# EAGLE design SPI_to_4x7SD-v22 (EAGLE 5.04)
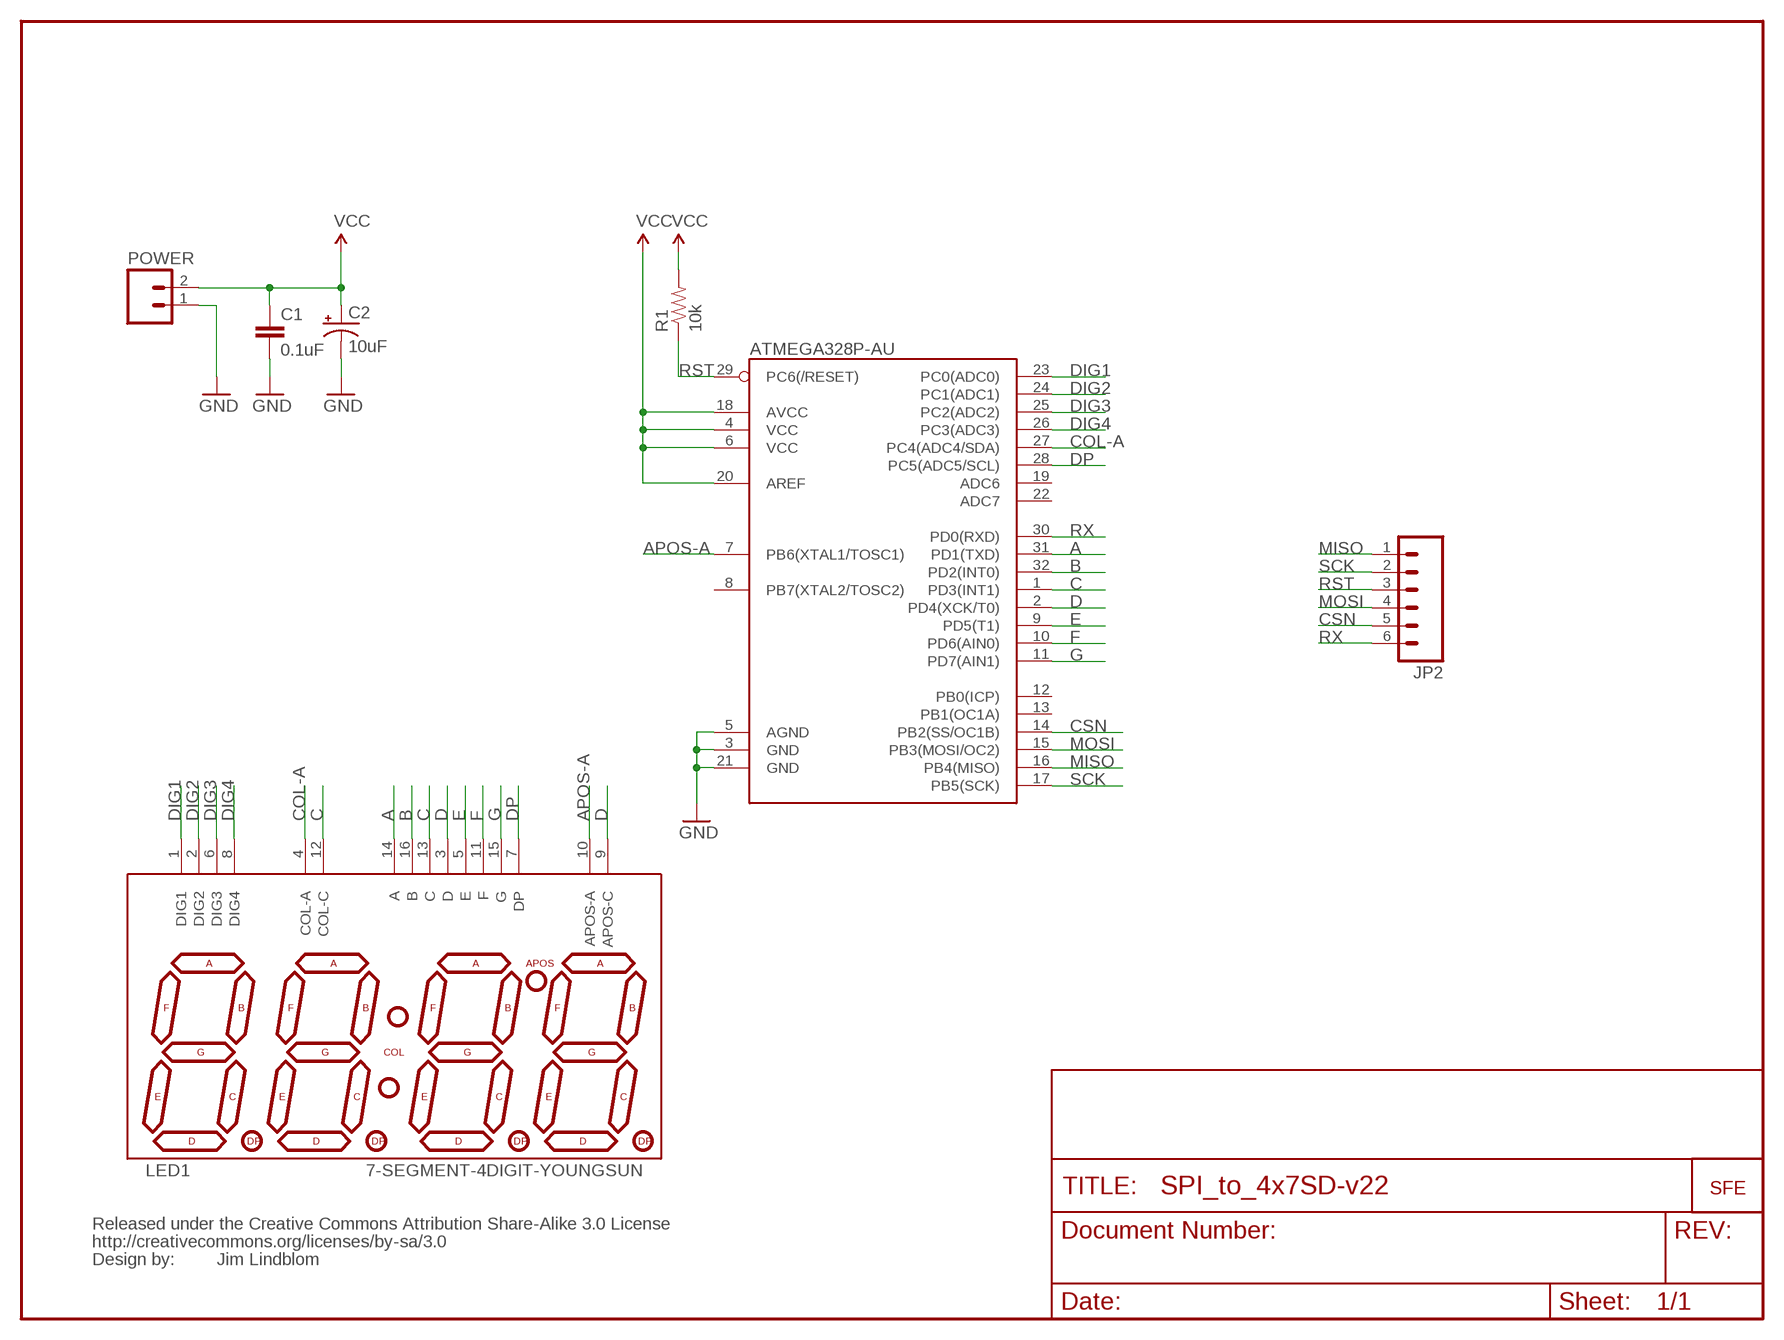
[diagram p0: schematic, sheet 1]

## Parts
ATMEGA328P-AU  ATMEGA328P-AU  ATMEGA168  [TQFP32-08]
C1  0.1uF  CAP0402-CAP  [0402-CAP]
C2  10uF  CAP_POL1206  [EIA3216]
JP2  M06SIP  [1X06]
LED1  7-SEGMENT-4DIGIT-YOUNGSUN  [7-SEGMENT-4DIGIT-YOUNGSUN]
POWER  JP2  M02PTH  [1X02]
R1  10k  RESISTOR0402-RES  [0402-RES]
U$1  CREATIVE_COMMONS  [CREATIVE_COMMONS]
U$3  LOGO-SFESK  [SFE-LOGO-FLAME]

## Nets
A: ATMEGA328P-AU.31(PD1(TXD)) LED1.14(A)
APOS-A: ATMEGA328P-AU.7(PB6(XTAL1/TOSC1)) LED1.10(APOS-A)
B: ATMEGA328P-AU.32(PD2(INT0)) LED1.16(B)
C: ATMEGA328P-AU.1(PD3(INT1)) LED1.12(COL-C) LED1.13(C)
COL-A: ATMEGA328P-AU.27(PC4(ADC4/SDA)) LED1.4(COL-A)
CSN: ATMEGA328P-AU.14(PB2(SS/OC1B)) JP2.5
D: ATMEGA328P-AU.2(PD4(XCK/T0)) LED1.3(D) LED1.9(APOS-C)
DIG1: ATMEGA328P-AU.23(PC0(ADC0)) LED1.1(DIG1)
DIG2: ATMEGA328P-AU.24(PC1(ADC1)) LED1.2(DIG2)
DIG3: ATMEGA328P-AU.25(PC2(ADC2)) LED1.6(DIG3)
DIG4: ATMEGA328P-AU.26(PC3(ADC3)) LED1.8(DIG4)
DP: ATMEGA328P-AU.28(PC5(ADC5/SCL)) LED1.7(DP)
E: ATMEGA328P-AU.9(PD5(T1)) LED1.5(E)
F: ATMEGA328P-AU.10(PD6(AIN0)) LED1.11(F)
G: ATMEGA328P-AU.11(PD7(AIN1)) LED1.15(G)
GND: ATMEGA328P-AU.3(GND) ATMEGA328P-AU.5(AGND) ATMEGA328P-AU.21(GND) C1.2 C2.C(-) POWER.1
MISO: ATMEGA328P-AU.16(PB4(MISO)) JP2.1
MOSI: ATMEGA328P-AU.15(PB3(MOSI/OC2)) JP2.4
RST: ATMEGA328P-AU.29(PC6(/RESET)) JP2.3 R1.1
RX: ATMEGA328P-AU.30(PD0(RXD)) JP2.6
SCK: ATMEGA328P-AU.17(PB5(SCK)) JP2.2
VCC: ATMEGA328P-AU.4(VCC) ATMEGA328P-AU.6(VCC) ATMEGA328P-AU.18(AVCC) ATMEGA328P-AU.20(AREF) C1.1 C2.A(+) POWER.2 R1.2
Unconnected: ATMEGA328P-AU.8(PB7(XTAL2/TOSC2)) ATMEGA328P-AU.12(PB0(ICP)) ATMEGA328P-AU.13(PB1(OC1A)) ATMEGA328P-AU.19(ADC6) ATMEGA328P-AU.22(ADC7)

## Notes on the sheet
- Jim Lindblom

## Library data of the parts
ATMEGA328P-AU = SparkFun:ATMEGA168
C1 = SparkFun:CAP: Capacitor Standard 0603 ceramic capacitor, and 0.1" leaded capacitor.
C2 = SparkFun:CAP_POL: Capacitor Polarized These are standard SMD and PTH capacitors. Normally 10uF, 47uF, and 100uF in electrolytic and tantalum varieties. Always verify the external diameter of the through hole cap, it varies with capacity, voltage, and manufacturer. The EIA devices should be standard.
JP2 = SparkFun:M06: Header 6 Standard 6-pin 0.1" header. Use with straight break away headers (SKU : PRT-00116), right angle break away headers (PRT-00553), swiss pins (PRT-00743), machine pins (PRT-00117), and female headers (PRT-00115). Molex polarized connector foot print use with SKU : PRT-08094 with associated crimp pins and housings. NOTES ON THE VARIANTS LOCK and LOCK_LONGPADS... This footprint was designed to help hold the alignment of a through-hole component (i.e. 6-pin header) while soldering it into place. You may notice that each hole has been shifted either up or down by 0.005 of an inch from it's more standard position (which is a perfectly straight line). This slight alteration caused the pins (the squares in the middle) to touch the edges of the holes. Because they are alternating, it causes a "brace" to hold the component in place. 0.005 has proven to be the perfect amount of "off-center" position when using our standard breakaway headers. Although looks a little odd when you look at the bare footprint, once you have a header in there, the alteration is very hard to notice. Also, if you push a header all the way into place, it is covered up entirely on the bottom side. This idea of altering the position of holes to aid alignment will be further integrated into the Sparkfun Library for other footprints. It can help hold any component with 3 or more connection pins.
LED1 = SparkFun:7-SEGMENT-4DIGIT-YOUNGSUN: This is a part for the 4-Digit 7-segment LEDs from Young Sun. Different from the Digikey LEDs, all 16 pins are used. The LONGPADS Variant is used for a test jig, but you may like it because there is more pad to solder to. If you are concerned about routing space, the standard works just fine though.
POWER = SparkFun:M02: Header 2 Standard 2-pin 0.1" header. Use with straight break away headers (SKU : PRT-00116), right angle break away headers (PRT-00553), swiss pins (PRT-00743), machine pins (PRT-00117), and female headers (PRT-00115). Molex polarized connector foot print use with SKU : PRT-08233 with associated crimp pins and housings.
R1 = SparkFun:RESISTOR: Resistor Basic schematic elements and footprints for 0603, 1206, and PTH 1/10th watt (small) resistors.
U$1 = SparkFun:CREATIVE_COMMONS
U$3 = SparkFun:LOGO-SFE: Spark Fun Electronics PCB Logo This is the standard Spark Fun Electronics PCB logo.

## Board
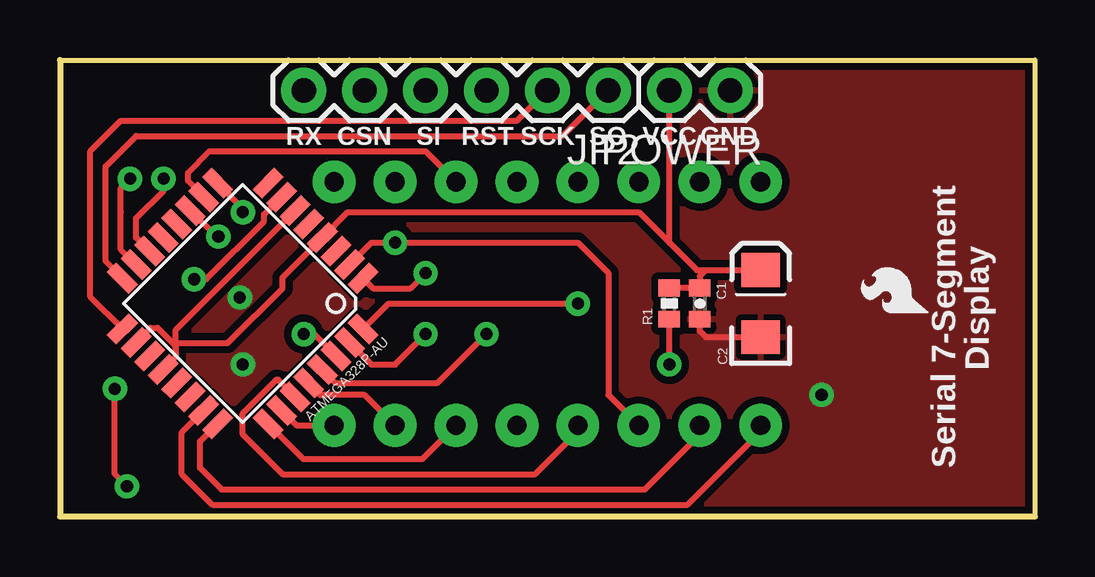
[diagram p1: board, top side]
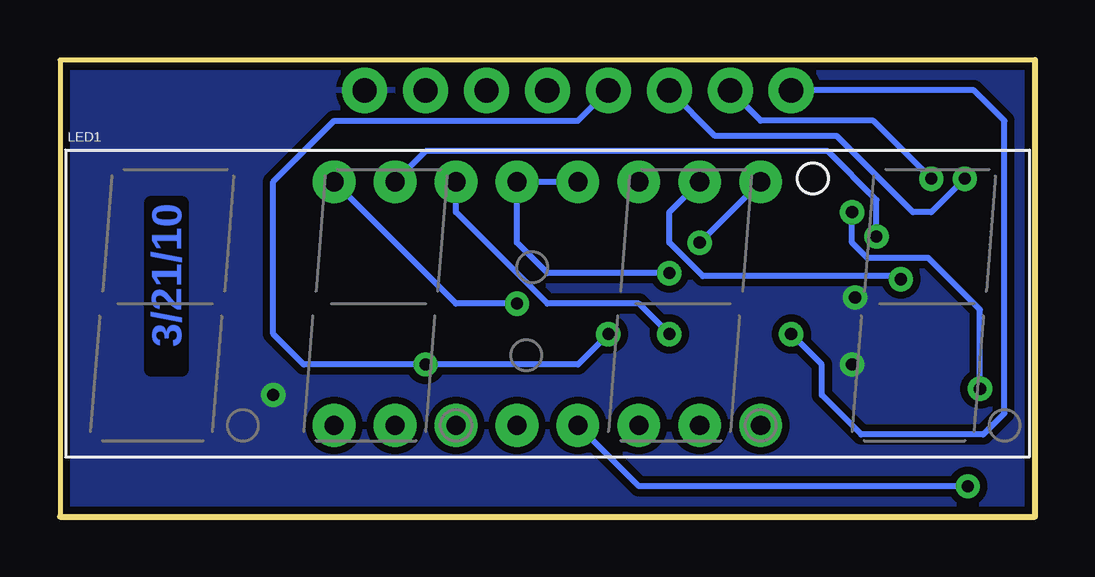
[diagram p2: board, bottom side, seen from below]

Size 40.64 x 19.05 mm. Coordinates in mm from the lower left corner, seen from the top.
Outline: 0,19.05 40.64,19.05 40.64,0 0,0 0,19.05
Copper layers (1*16): Top 0.035mm / dielectric 1.5mm / Bottom 0.035mm
Design rules "SparkFun": minimum track width 8mil, minimum drill 20mil, track to track 8mil, track to pad 8mil, pad to pad 8mil, via to via 8mil, smd to smd 8mil, copper to edge 10mil, drill to drill 8mil, minimum pad ring 12mil, minimum via ring 10mil, stop-mask expansion 4mil, vias tented up to drill 25mil, thermal gap 10mil

### Footprints (pad centres in the part's own frame; a part is rotated, then mirrored left to right if it is on the bottom)
TQFP32-08 = smd 1.27 x 0.559: 1 -4.293,2.8; 2 -4.293,2; 3 -4.293,1.2; 4 -4.293,0.4; 5 -4.293,-0.4; 6 -4.293,-1.2; 7 -4.293,-2; 8 -4.293,-2.8; 17 4.293,-2.8; 18 4.293,-2; 19 4.293,-1.2; 20 4.293,-0.4; 21 4.293,0.4; 22 4.293,1.2; 23 4.293,2; 24 4.293,2.8 | smd 0.559 x 1.27: 9 -2.8,-4.293; 10 -2,-4.293; 11 -1.2,-4.293; 12 -0.4,-4.293; 13 0.4,-4.293; 14 1.2,-4.293; 15 2,-4.293; 16 2.8,-4.293; 25 2.8,4.293; 26 2,4.293; 27 1.2,4.293; 28 0.4,4.293; 29 -0.4,4.293; 30 -1.2,4.293; 31 -2,4.293; 32 -2.8,4.293
0402-CAP = smd 0.7 x 0.9: 1 -0.65,0; 2 0.65,0
EIA3216 = smd 1.4 x 1.6: A 1.4,0; C -1.4,0
1X06 = drill 1.016 pad 1.88 round: 1 0,0; 2 2.54,0; 3 5.08,0; 4 7.62,0; 5 10.16,0; 6 12.7,0
7-SEGMENT-4DIGIT-YOUNGSUN = drill 0.8 pad 1.778 round: 1 -8.89,-5.08; 2 -6.35,-5.08; 3 -3.81,-5.08; 4 -1.27,-5.08; 5 1.27,-5.08; 6 3.81,-5.08; 7 6.35,-5.08; 8 8.89,-5.08; 9 8.89,5.08; 10 6.35,5.08; 11 3.81,5.08; 12 1.27,5.08; 13 -1.27,5.08; 14 -3.81,5.08; 15 -6.35,5.08; 16 -8.89,5.08
1X02 = drill 1.016 pad 1.88 round: 1 0,0; 2 2.54,0
0402-RES = smd 0.7 x 0.9: 1 -0.65,0; 2 0.65,0

### Placement (x,y rotation side)
ATMEGA328P-AU  7.62,8.89 225 top
C1  26.67,8.89 270 top
C2  29.21,8.89 90 top
JP2  22.86,17.78 180 top
LED1  20.32,8.89 0 bottom
POWER  27.94,17.78 180 top
R1  25.4,8.89 90 top
U$1  20.32,-7.62 0 top  (outside the outline)
U$3  36.2,8.51 90 top

### Tracks (layer width: path | path; a pad name or v marks a point on that pad's centre or on a via)
A  (via drill 0.51)
  Top 0.254: ATMEGA328P-AU.31 12.99,6.35 13.97,6.35 v15.24,7.62
  Bottom 0.254: v15.24,7.62 16.51,8.89 20.32,8.89 24.13,12.7 LED1.14
APOS-A  (via drill 0.51)
  Top 0.254: ATMEGA328P-AU.7 8.51,12.61 8.51,12.32 6.1,9.91 v5.59,9.91
  Bottom 0.254: LED1.10 15.24,12.7 15.24,11.43 13.84,10.03 5.71,10.03 v5.59,9.91
B  (via drill 0.51)
  Top 0.254: ATMEGA328P-AU.32 13.69,8.89 v21.59,8.89
  Bottom 0.254: v21.59,8.89 24.13,8.89 LED1.16
C  (via drill 0.51)
  Top 0.254: ATMEGA328P-AU.1 13.06,9.53 14.61,9.53 v15.24,10.16
  Bottom 0.254: v15.24,10.16 20.32,10.16 21.59,11.43 LED1.13 LED1.12
COL-A
  Top 0.254: ATMEGA328P-AU.27 9.1,5.71 9.02,5.71 7.62,4.32 7.62,3.43 9.27,1.78 19.81,1.78 21.59,3.56 LED1.4
CSN  (via drill 0.51)
  Top 0.254: ATMEGA328P-AU.14 3.17,11.64 3.17,12.45 4.32,13.59 v4.32,14.1
  Bottom 0.254: v4.32,14.1 6.73,16.51 11.43,16.51 JP2.5
D  (via drill 0.51)
  Top 0.254: ATMEGA328P-AU.2 12.99,11.43 v13.97,11.43 21.59,11.43 22.86,10.16 22.86,5.08 LED1.3
  Bottom 0.254: v13.97,11.43 LED1.9
DIG1
  Top 0.254: ATMEGA328P-AU.23 5.08,3.52 5.08,1.78 6.35,0.51 26.16,0.51 29.21,3.56 LED1.1
DIG2
  Top 0.254: LED1.2 26.67,3.43 24.38,1.14 6.73,1.14 5.84,2.03 5.84,3.15 ATMEGA328P-AU.24
DIG3
  Top 0.254: LED1.6 15.11,2.41 10.14,2.41 ATMEGA328P-AU.25
DIG4
  Top 0.254: ATMEGA328P-AU.26 9.87,3.81 LED1.8
DP
  Top 0.254: ATMEGA328P-AU.28 10.86,5.08 12.7,5.08 LED1.7
E  (via drill 0.51)
  Top 0.254: ATMEGA328P-AU.9 7.62,12.85 v7.62,12.7 | v2.29,5.33 2.29,1.78 v2.79,1.27
  Bottom 0.254: v7.62,12.7 7.62,11.43 6.99,10.79 4.45,10.79 2.29,8.64 v2.29,5.33 | v2.79,1.27 16.51,1.27 LED1.5
F
  Top 0.254: ATMEGA328P-AU.10 5.33,14 5.33,14.35 6.22,15.24 15.24,15.24 LED1.11
G  (via drill 0.51)
  Top 0.254: ATMEGA328P-AU.11 6.52,11.68 v6.6,11.68
  Bottom 0.254: v6.6,11.68 6.6,13.21 8.64,15.24 25.4,15.24 LED1.15
GND  (via drill 0.51)
  Top 0.254: C1.2 26.67,7.75 26.92,7.49 C2.C
  other vias: 7.49,9.14 7.62,6.35 31.75,5.08
  pour Top (isolate 0.305): 0,0 0,19.05 40.64,19.05 40.64,0
  pour Bottom (isolate 0.305): 0,0 0,19.05 40.64,19.05 40.64,0
MISO
  Top 0.254: JP2.1 20.95,15.88 3.17,15.88 1.91,14.61 1.91,10.67 2.6,9.97 ATMEGA328P-AU.16
MOSI  (via drill 0.51)
  Top 0.254: ATMEGA328P-AU.15 2.54,11.14 2.54,12.7 2.54,13.72 v2.92,14.1
  Bottom 0.254: v2.92,14.1 4.32,12.7 5.08,12.7 8.26,15.88 13.34,15.88 JP2.4
RST  (via drill 0.51)
  Top 0.254: ATMEGA328P-AU.29 11.49,5.59 15.75,5.59 v17.78,7.62 | v25.4,6.35 R1.1
  Bottom 0.254: JP2.3 19.05,16.51 29.21,16.51 31.75,13.97 31.75,7.62 30.48,6.35 v25.4,6.35 19.05,6.35 v17.78,7.62
RX  (via drill 0.51)
  Top 0.254: ATMEGA328P-AU.30 10.59,7.62 v10.16,7.62
  Bottom 0.254: JP2.6 2.54,17.78 1.27,16.51 1.27,4.32 2.16,3.43 7.24,3.43 8.89,5.08 8.89,6.35 v10.16,7.62
SCK
  Top 0.254: ATMEGA328P-AU.17 1.27,9.17 1.27,15.24 2.54,16.51 19.05,16.51 JP2.2
VCC
  Top 0.254: 4.83,6.66 ATMEGA328P-AU.20 | 4.83,6.66 4.83,7.11 4.7,7.24 | ATMEGA328P-AU.18 3.78,7.87 4.06,7.87 4.7,7.24 | R1.2 C1.1 26.67,10.03 26.92,10.29 | 26.92,10.29 C2.A | 26.92,10.29 26.54,10.29 25.4,11.43 | 25.4,11.43 POWER.2 | 25.4,11.43 24.13,12.7 12,12.7 ATMEGA328P-AU.4 9.27,9.97 9.27,9.53 6.99,7.24 4.7,7.24 | ATMEGA328P-AU.6 4.83,7.79 4.83,6.66

### Text on the board
Bottom: 3/21/10
tPlace: RX | CSN | SI | RST | SCK | SO | VCC | GND | Display | Serial 7-Segment